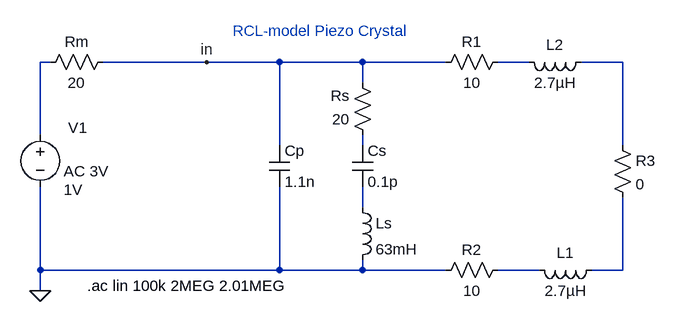
[diagram p0: schematic Draft1.asc]
Draft1.asc, the LTspice schematic file:
Version 4
SHEET 1 1044 680
WIRE -16 96 -32 96
WIRE 224 96 64 96
WIRE 336 96 224 96
WIRE 464 96 336 96
WIRE 592 96 464 96
WIRE 720 96 672 96
WIRE 864 96 800 96
WIRE 464 128 464 96
WIRE -32 208 -32 96
WIRE 336 224 336 96
WIRE 464 224 464 208
WIRE 864 224 864 96
WIRE 464 320 464 288
WIRE -32 416 -32 288
WIRE 336 416 336 288
WIRE 336 416 -32 416
WIRE 464 416 464 400
WIRE 464 416 336 416
WIRE 592 416 464 416
WIRE 736 416 672 416
WIRE 864 416 864 304
WIRE 864 416 816 416
WIRE -32 448 -32 416
FLAG 224 96 in
FLAG -32 448 0
SYMBOL res -32 112 R270
WINDOW 0 32 56 VTop 2
WINDOW 3 0 56 VBottom 2
SYMATTR InstName Rm
SYMATTR Value 20
SYMBOL res 480 224 R180
WINDOW 0 36 76 Left 2
WINDOW 3 36 40 Left 2
SYMATTR InstName Rs
SYMATTR Value 20
SYMBOL cap 448 224 R0
SYMATTR InstName Cs
SYMATTR Value 0.1p
SYMBOL cap 320 224 R0
SYMATTR InstName Cp
SYMATTR Value 1.1n
SYMBOL ind 448 304 R0
SYMATTR InstName Ls
SYMATTR Value 63mH
SYMBOL voltage -32 192 R0
WINDOW 0 43 5 Left 2
WINDOW 3 36 100 Left 2
WINDOW 123 36 72 Left 2
WINDOW 39 0 0 Left 2
SYMATTR InstName V1
SYMATTR Value 1V
SYMATTR Value2 AC 3V
SYMBOL ind 816 80 R90
WINDOW 0 5 56 VBottom 2
WINDOW 3 32 56 VTop 2
SYMATTR InstName L2
SYMATTR Value 2.7µH
SYMATTR SpiceLine Rser=1.1
SYMBOL ind 832 400 R90
WINDOW 0 5 56 VBottom 2
WINDOW 3 32 56 VTop 2
SYMATTR InstName L1
SYMATTR Value 2.7µH
SYMATTR SpiceLine Rser=1.1
SYMBOL res 688 80 R90
WINDOW 0 0 56 VBottom 2
WINDOW 3 32 56 VTop 2
SYMATTR InstName R1
SYMATTR Value 10
SYMBOL res 688 400 R90
WINDOW 0 0 56 VBottom 2
WINDOW 3 32 56 VTop 2
SYMATTR InstName R2
SYMATTR Value 10
SYMBOL res 848 208 R0
SYMATTR InstName R3
SYMATTR Value 0
TEXT 40 440 Left 2 !.ac lin 100k 2MEG 2.01MEG
TEXT 264 48 Left 2 ;RCL-model Piezo Crystal

The netlist it stands for:
* Draft1.asc
Rm N001 in 20
Rs N004 in 20
Cs N004 N005 0.1p
Cp in 0 1.1n
Ls N005 0 63mH
V1 N001 0 1V AC 3V
L2 N003 N002 2.7µH Rser=1.1
L1 N007 N006 2.7µH Rser=1.1
R1 N002 in 10
R2 N006 0 10
R3 N003 N007 0
.ac lin 100k 2MEG 2.01MEG
* RCL-model Piezo Crystal
.backanno
.end